# Altium schematic sheet [07] RFID_LCD.SchDoc
size A4
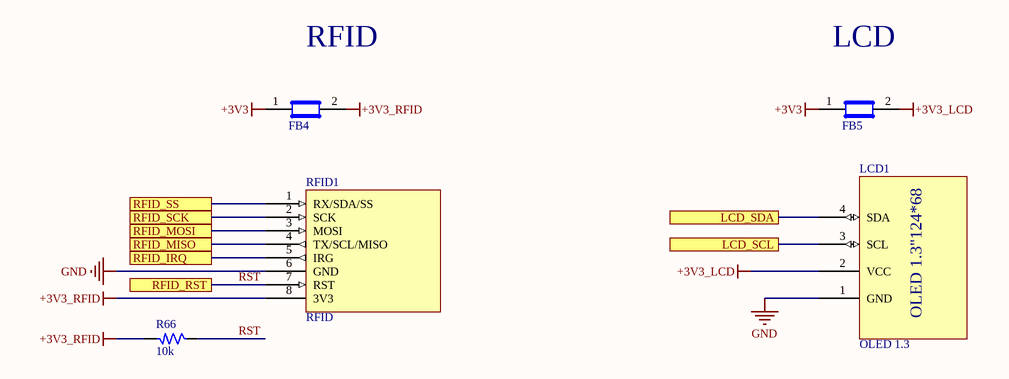
[diagram p0: [07] RFID_LCD.SchDoc]

## Parts
FB4  BLM21PG600SN1D  [R0805]  (value not drawn)
FB5  BLM21PG600SN1D  [R0805]  (value not drawn)
LCD1  OLED 1.3  [OLED 1.3]
R66  10k  [R0805]
RFID1  RFID  [RFID RC522]

## Ports
LCD_SCL, LCD_SDA, RFID_IRQ, RFID_MISO, RFID_MOSI, RFID_RST, RFID_SCK, RFID_SS

## Nets
+3V3: FB4.1 FB5.1
+3V3_LCD: FB5.2 LCD1.2(VCC)
+3V3_RFID: FB4.2 R66.2 RFID1.8(3V3)
GND: LCD1.1(GND) RFID1.6(GND)
LCD_SCL: LCD1.3(SCL) ; port LCD_SCL
LCD_SDA: LCD1.4(SDA) ; port LCD_SDA
RFID_IRQ: RFID1.5(IRG) ; port RFID_IRQ
RFID_MISO: RFID1.4(TX/SCL/MISO) ; port RFID_MISO
RFID_MOSI: RFID1.3(MOSI) ; port RFID_MOSI
RFID_SCK: RFID1.2(SCK) ; port RFID_SCK
RFID_SS: RFID1.1(RX/SDA/SS) ; port RFID_SS
RST: R66.1 RFID1.7(RST) ; port RFID_RST

## Notes on the sheet
- RFID
- LCD
- (in symbol OLED 1.3) OLED 1.3"124*68

## Library data of the parts
FB4 FB5 = Ferrite Bead
R66 = RM: Resistor SMD; Value: 1K
RFID1 = RFID RC522